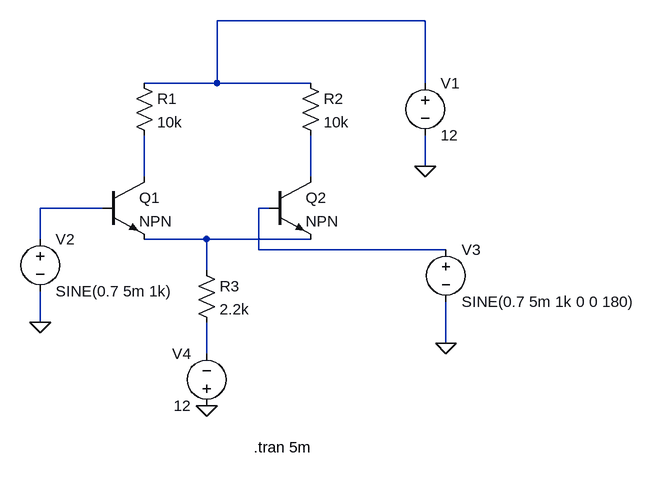
[diagram p0: schematic BJT differntial.asc]
BJT differntial.asc, the LTspice schematic file:
Version 4.1
SHEET 1 972 680
WIRE 624 -96 304 -96
WIRE 304 0 304 -96
WIRE 304 0 192 0
WIRE 448 0 304 0
WIRE 624 0 624 -96
WIRE 624 128 624 80
WIRE 192 144 192 80
WIRE 448 144 448 80
WIRE 128 192 32 192
WIRE 384 192 368 192
WIRE 32 240 32 192
WIRE 288 240 192 240
WIRE 448 240 288 240
WIRE 368 256 368 192
WIRE 656 256 368 256
WIRE 288 288 288 240
WIRE 32 368 32 320
WIRE 656 400 656 336
WIRE 288 416 288 368
FLAG 32 368 0
FLAG 656 400 0
FLAG 624 128 0
FLAG 288 496 0
SYMBOL npn 128 144 R0
SYMATTR InstName Q1
SYMBOL npn 384 144 R0
SYMATTR InstName Q2
SYMBOL res 176 -16 R0
SYMATTR InstName R1
SYMATTR Value 10k
SYMBOL res 432 -16 R0
SYMATTR InstName R2
SYMATTR Value 10k
SYMBOL res 272 272 R0
SYMATTR InstName R3
SYMATTR Value 2.2k
SYMBOL voltage 624 -16 R0
WINDOW 123 0 0 Left 0
WINDOW 39 0 0 Left 0
SYMATTR InstName V1
SYMATTR Value 12
SYMBOL voltage 32 224 R0
WINDOW 123 0 0 Left 0
WINDOW 39 0 0 Left 0
SYMATTR InstName V2
SYMATTR Value SINE(0.7 5m 1k)
SYMBOL voltage 656 240 R0
WINDOW 123 0 0 Left 0
WINDOW 39 0 0 Left 0
SYMATTR InstName V3
SYMATTR Value SINE(0.7 5m 1k 0 0 180)
SYMBOL voltage 288 512 R180
WINDOW 0 24 96 Left 2
WINDOW 3 24 16 Left 2
WINDOW 123 0 0 Left 0
WINDOW 39 0 0 Left 0
SYMATTR InstName V4
SYMATTR Value 12
TEXT 360 560 Left 2 !.tran 5m

The netlist it stands for:
* BJT differntial.asc
Q1 N002 N004 N006 0 NPN
Q2 N003 N005 N006 0 NPN
R1 N001 N002 10k
R2 N001 N003 10k
R3 N006 N007 2.2k
V1 N001 0 12
V2 N004 0 SINE(0.7 5m 1k)
V3 N005 0 SINE(0.7 5m 1k 0 0 180)
V4 0 N007 12
.model NPN NPN
.model PNP PNP
.lib standard.bjt
.tran 5m
.backanno
.end